# EAGLE design foxBMS_BMS-Interface_V1.00 (EAGLE 6.5.0)
AUTHOR: Fraunhofer IISB foxBMS Team; REL-DATE: 2016-05-20; TITLE: foxBMS BMS-Interface; VERSION: 1.00

## Sheet 1 of 5: Realisierung Jumper
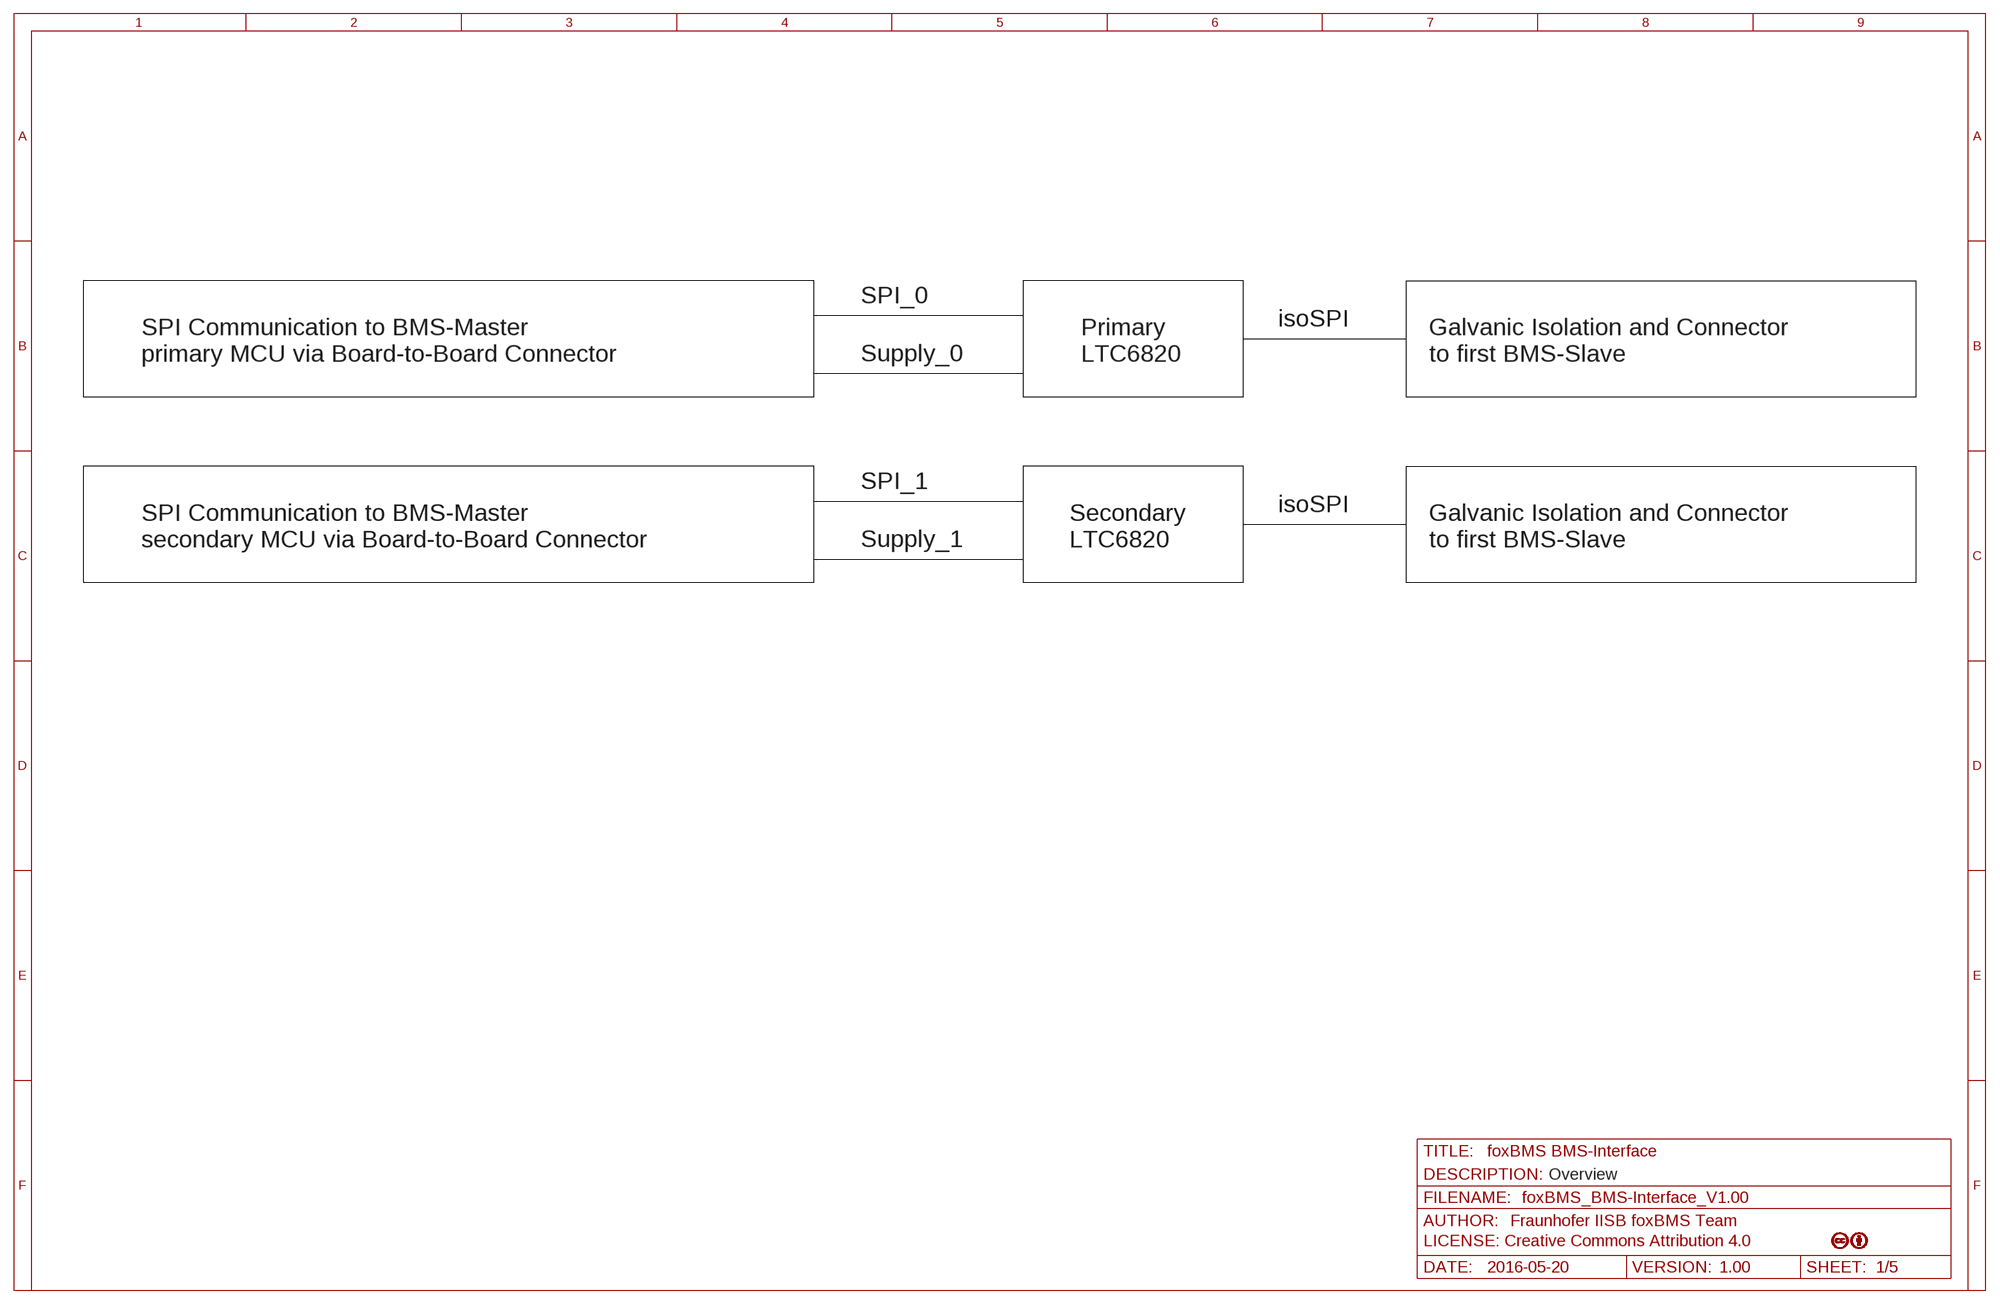
[diagram p0: schematic, sheet 1]

### Notes on the sheet
- SPI_0
- isoSPI
- SPI Communication to BMS-Master
  primary MCU via Board-to-Board Connector
- Supply_0
- Primary
  LTC6820
- Galvanic Isolation and Connector
  to first BMS-Slave
- SPI_1
- isoSPI
- SPI Communication to BMS-Master
  secondary MCU via Board-to-Board Connector
- Supply_1
- Secondary
  LTC6820
- Galvanic Isolation and Connector
  to first BMS-Slave
- Overview

## Sheet 2 of 5
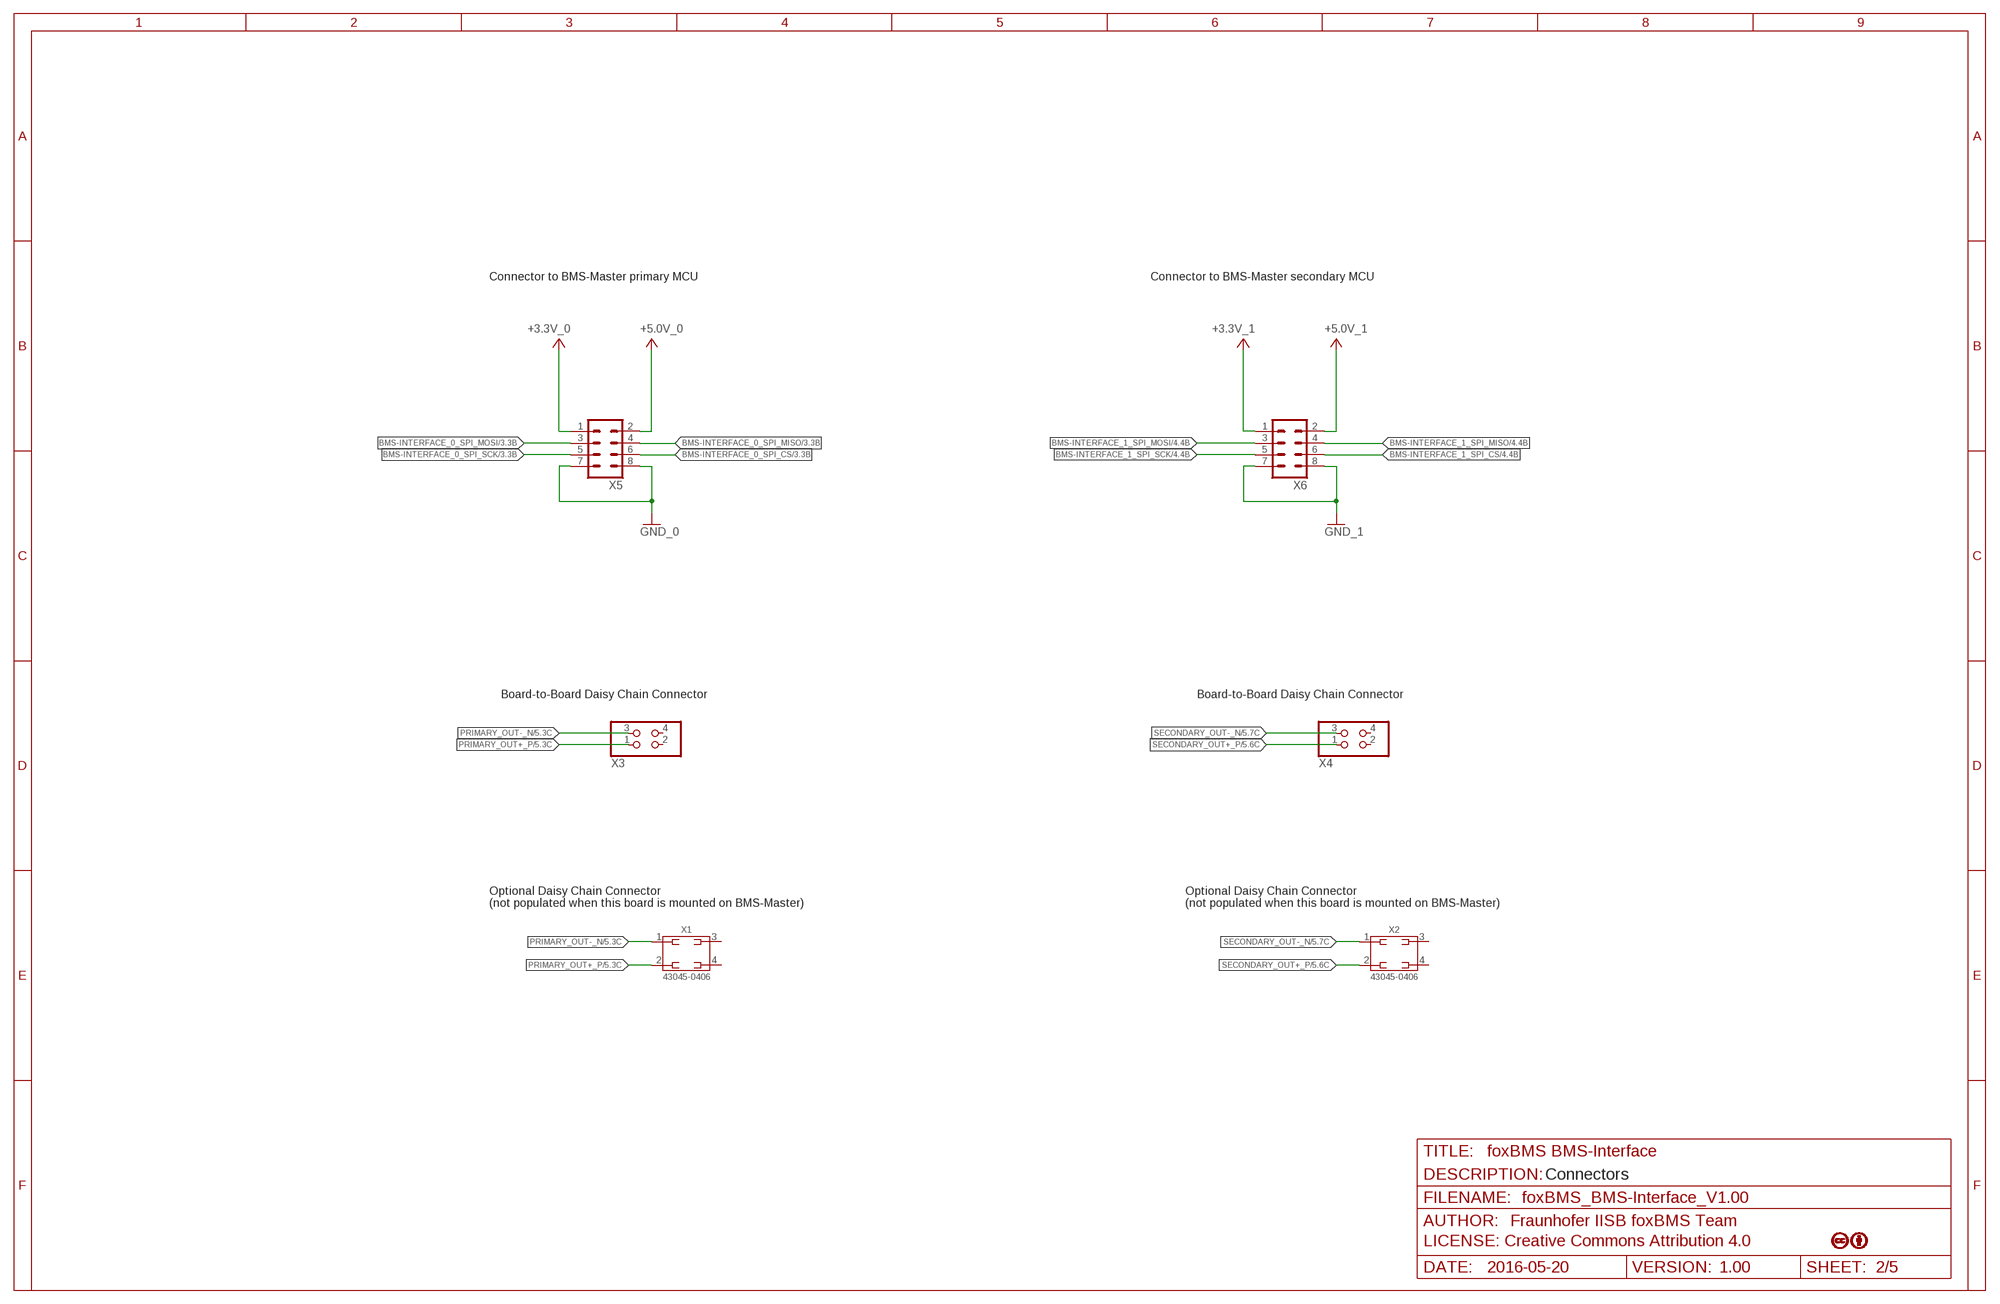
[diagram p1: schematic, sheet 2]

### Parts
X1  43045-0406_MOLEX_4PIN  [X_SMD_MOLEX_43045-0408_R_REV01]
X2  43045-0406_MOLEX_4PIN  [X_SMD_MOLEX_43045-0408_R_REV01]
X3  PINHD-2X2  [2X02]
X4  PINHD-2X2  [2X02]
X5  MA04-2  [MA04-2]
X6  MA04-2  [MA04-2]

### Nets
+3.3V_0: X5.1 ; also sheet 3
+3.3V_1: X6.1 ; also sheet 4
+5.0V_0: X5.2
+5.0V_1: X6.2
BMS-INTERFACE_0_SPI_CS: X5.6 ; also sheet 3
BMS-INTERFACE_0_SPI_MISO: X5.4 ; also sheet 3
BMS-INTERFACE_0_SPI_MOSI: X5.3 ; also sheet 3
BMS-INTERFACE_0_SPI_SCK: X5.5 ; also sheet 3
BMS-INTERFACE_1_SPI_CS: X6.6 ; also sheet 4
BMS-INTERFACE_1_SPI_MISO: X6.4 ; also sheet 4
BMS-INTERFACE_1_SPI_MOSI: X6.3 ; also sheet 4
BMS-INTERFACE_1_SPI_SCK: X6.5 ; also sheet 4
GND_0: X5.7 X5.8 ; also sheet 3,5
GND_1: X6.7 X6.8 ; also sheet 4,5
PRIMARY_OUT+_P [DiffPair]: X1.2 X3.1 ; also sheet 5
PRIMARY_OUT-_N [DiffPair]: X1.1 X3.3 ; also sheet 5
SECONDARY_OUT+_P: X2.2 X4.1 ; also sheet 5
SECONDARY_OUT-_N: X2.1 X4.3 ; also sheet 5
Unconnected: X1.3 X1.4 X2.3 X2.4 X3.2 X3.4 X4.2 X4.4

### Notes on the sheet
- Connector to BMS-Master primary MCU | Connector to BMS-Master secondary MCU
- Board-to-Board Daisy Chain Connector | Board-to-Board Daisy Chain Connector
- Optional Daisy Chain Connector
  (not populated when this board is mounted on BMS-Master)
- Optional Daisy Chain Connector
  (not populated when this board is mounted on BMS-Master)
- Connectors

## Sheet 3 of 5: IC 1
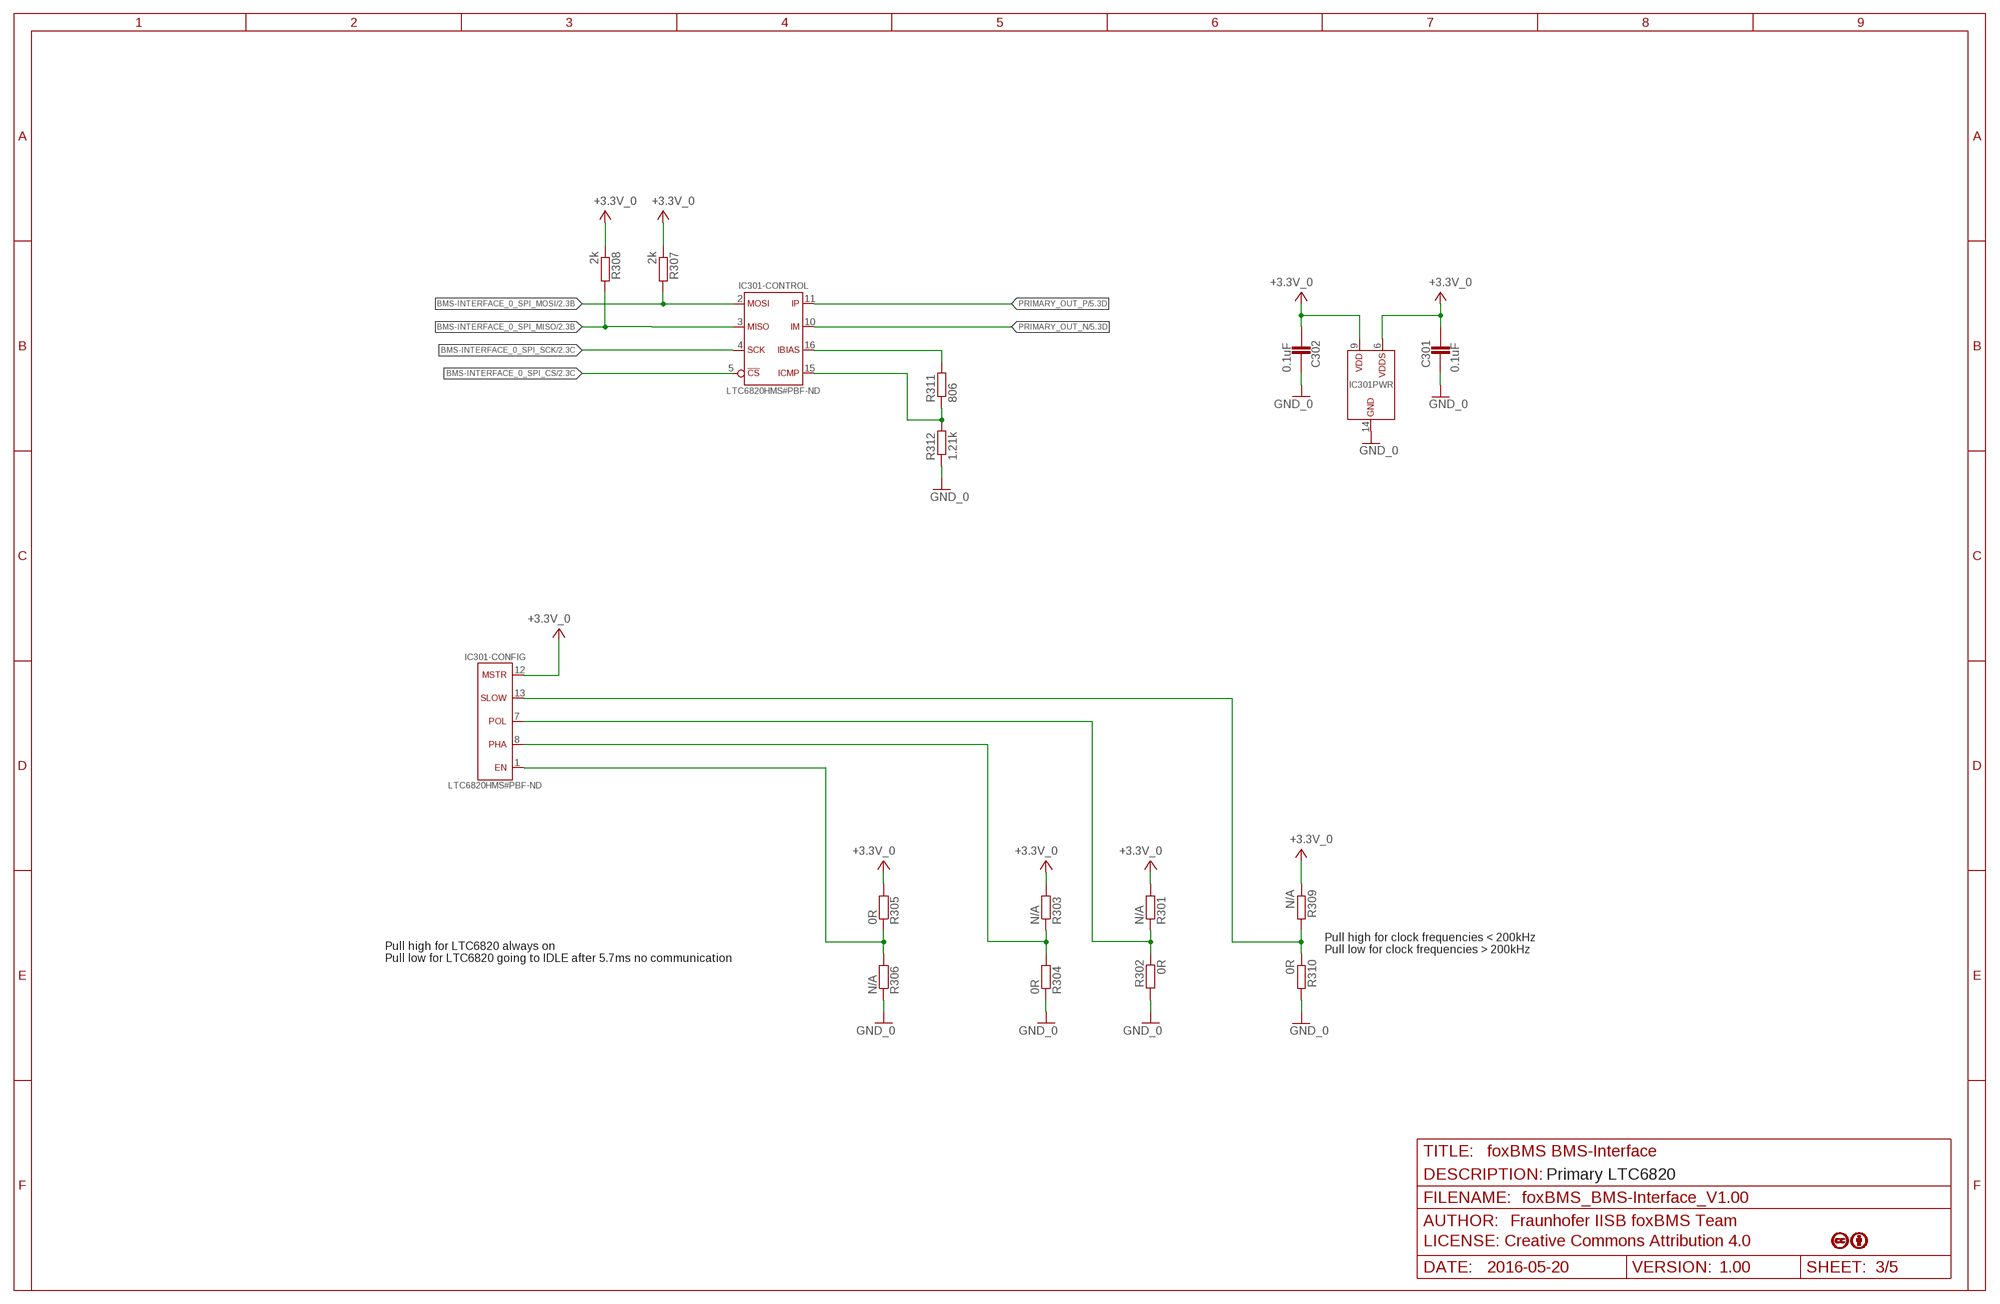
[diagram p2: schematic, sheet 3]

### Parts
C301  0.1uF  C_NP0_0603  [0603]
C302  0.1uF  C_NP0_0603  [0603]
IC301  LTC6820HMS#PBF  [IC_SMD_MSOP-16_(MS16)_R_LINEAR_REV01]
R301  N/A  R_MET_0603  [0603]
R302  0R  R_MET_0603  [0603]
R303  N/A  R_MET_0603  [0603]
R304  0R  R_MET_0603  [0603]
R305  0R  R_MET_0603  [0603]
R306  N/A  R_MET_0603  [0603]
R307  2k  R_MET_0603  [0603]
R308  2k  R_MET_0603  [0603]
R309  N/A  R_MET_0603  [0603]
R310  0R  R_MET_0603  [0603]
R311  806  R_MET_0603  [0603]
R312  1.21k  R_MET_0603  [0603]

### Nets
+3.3V_0: C301.2 C302.2 IC301.6(PWR:VDDS) IC301.9(PWR:VDD) IC301.12(-CONFIG:MSTR) R301.2 R303.2 R305.2 R307.1 R308.1 R309.1 ; also sheet 2
BMS-INTERFACE_0_SPI_CS: IC301.5(-CONTROL:!CS) ; also sheet 2
BMS-INTERFACE_0_SPI_MISO: IC301.3(-CONTROL:MISO) R308.2 ; also sheet 2
BMS-INTERFACE_0_SPI_MOSI: IC301.2(-CONTROL:MOSI) R307.2 ; also sheet 2
BMS-INTERFACE_0_SPI_SCK: IC301.4(-CONTROL:SCK) ; also sheet 2
EN-BACKUP: IC301.1(-CONFIG:EN) R305.1 R306.2
GND_0: C301.1 C302.1 IC301.14(PWR:GND) R302.2 R304.1 R306.1 R310.2 R312.1 ; also sheet 2,5
N$13: IC301.16(-CONTROL:IBIAS) R311.2
N$15: IC301.15(-CONTROL:ICMP) R311.1 R312.2
PHA-PRIMARY: IC301.8(-CONFIG:PHA) R303.1 R304.2
POL-PRIMARY: IC301.7(-CONFIG:POL) R301.1 R302.1
PRIMARY_OUT_N [DiffPair]: IC301.10(-CONTROL:IM) ; also sheet 5
PRIMARY_OUT_P [DiffPair]: IC301.11(-CONTROL:IP) ; also sheet 5
SLOW-PRIMARY: IC301.13(-CONFIG:SLOW) R309.2 R310.1

### Notes on the sheet
- Pull high for LTC6820 always on
  Pull low for LTC6820 going to IDLE after 5.7ms no communication
- Pull high for clock frequencies < 200kHz
  Pull low for clock frequencies > 200kHz
- Primary LTC6820

## Sheet 4 of 5: IC2
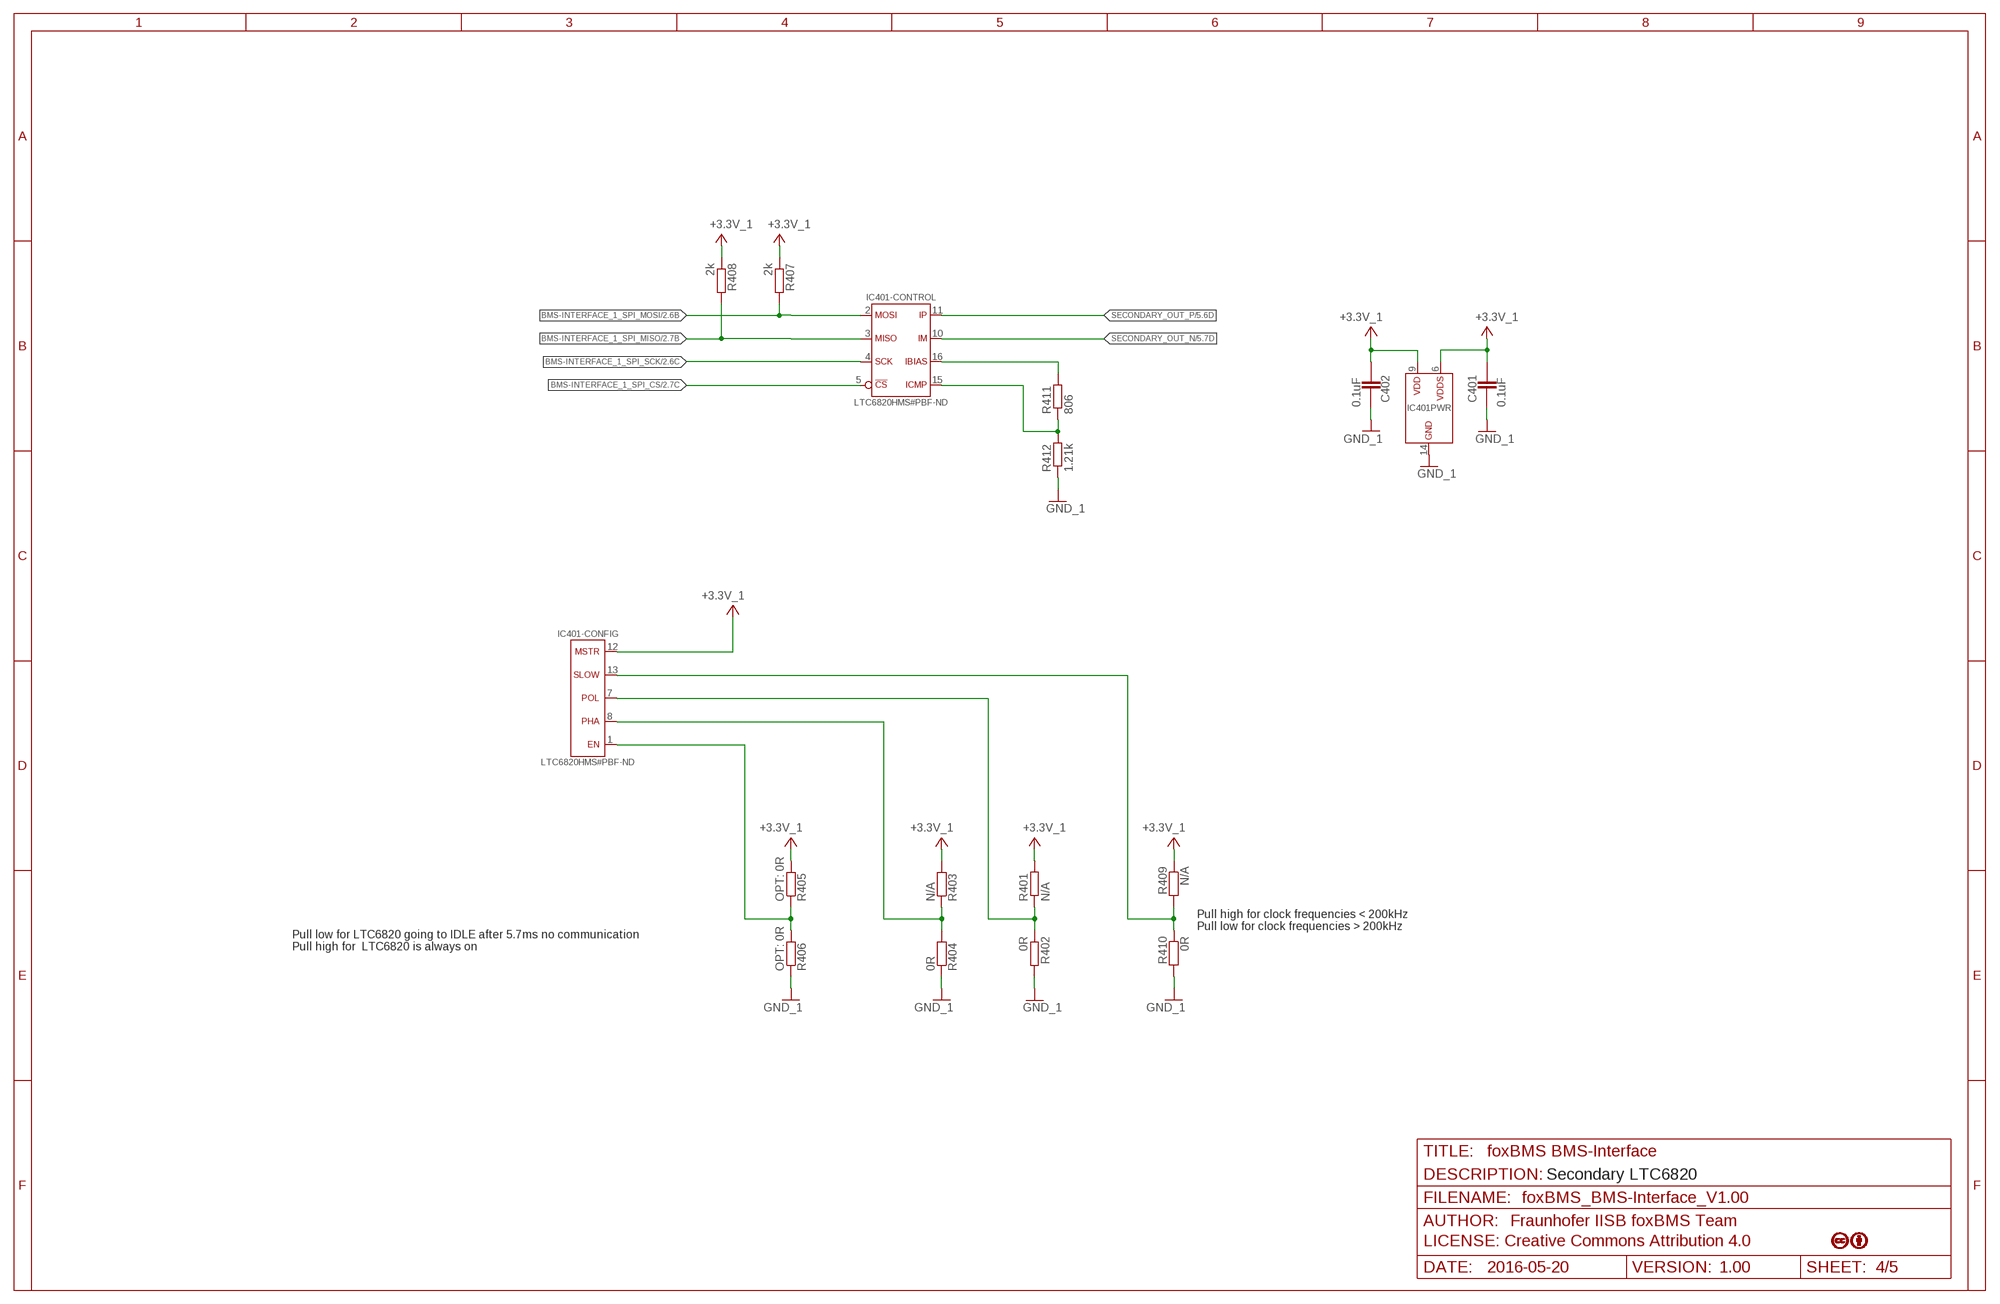
[diagram p3: schematic, sheet 4]

### Parts
C401  0.1uF  C_NP0_0603  [0603]
C402  0.1uF  C_NP0_0603  [0603]
IC401  LTC6820HMS#PBF  [IC_SMD_MSOP-16_(MS16)_R_LINEAR_REV01]
R401  N/A  R_MET_0603  [0603]
R402  0R  R_MET_0603  [0603]
R403  N/A  R_MET_0603  [0603]
R404  0R  R_MET_0603  [0603]
R405  OPT: 0R  R_MET_0603  [0603]
R406  OPT: 0R  R_MET_0603  [0603]
R407  2k  R_MET_0603  [0603]
R408  2k  R_MET_0603  [0603]
R409  N/A  R_MET_0603  [0603]
R410  0R  R_MET_0603  [0603]
R411  806  R_MET_0603  [0603]
R412  1.21k  R_MET_0603  [0603]

### Nets
+3.3V_1: C401.2 C402.2 IC401.6(PWR:VDDS) IC401.9(PWR:VDD) IC401.12(-CONFIG:MSTR) R401.2 R403.2 R405.2 R407.1 R408.1 R409.1 ; also sheet 2
BMS-INTERFACE_1_SPI_CS: IC401.5(-CONTROL:!CS) ; also sheet 2
BMS-INTERFACE_1_SPI_MISO: IC401.3(-CONTROL:MISO) R408.2 ; also sheet 2
BMS-INTERFACE_1_SPI_MOSI: IC401.2(-CONTROL:MOSI) R407.2 ; also sheet 2
BMS-INTERFACE_1_SPI_SCK: IC401.4(-CONTROL:SCK) ; also sheet 2
EN-BACKUP1: IC401.1(-CONFIG:EN) R405.1 R406.2
GND_1: C401.1 C402.1 IC401.14(PWR:GND) R402.2 R404.1 R406.1 R410.2 R412.1 ; also sheet 2,5
N$1: IC401.15(-CONTROL:ICMP) R411.1 R412.2
N$4: IC401.16(-CONTROL:IBIAS) R411.2
PHA-SECONDARY: IC401.8(-CONFIG:PHA) R403.1 R404.2
POL-SECONDARY: IC401.7(-CONFIG:POL) R401.1 R402.1
SECONDARY_OUT_N: IC401.10(-CONTROL:IM) ; also sheet 5
SECONDARY_OUT_P: IC401.11(-CONTROL:IP) ; also sheet 5
SLOW-SECONDARY: IC401.13(-CONFIG:SLOW) R409.2 R410.1

### Notes on the sheet
- Pull low for LTC6820 going to IDLE after 5.7ms no communication
  Pull high for  LTC6820 is always on
- Pull high for clock frequencies < 200kHz
  Pull low for clock frequencies > 200kHz
- Secondary LTC6820

## Sheet 5 of 5: Stecker
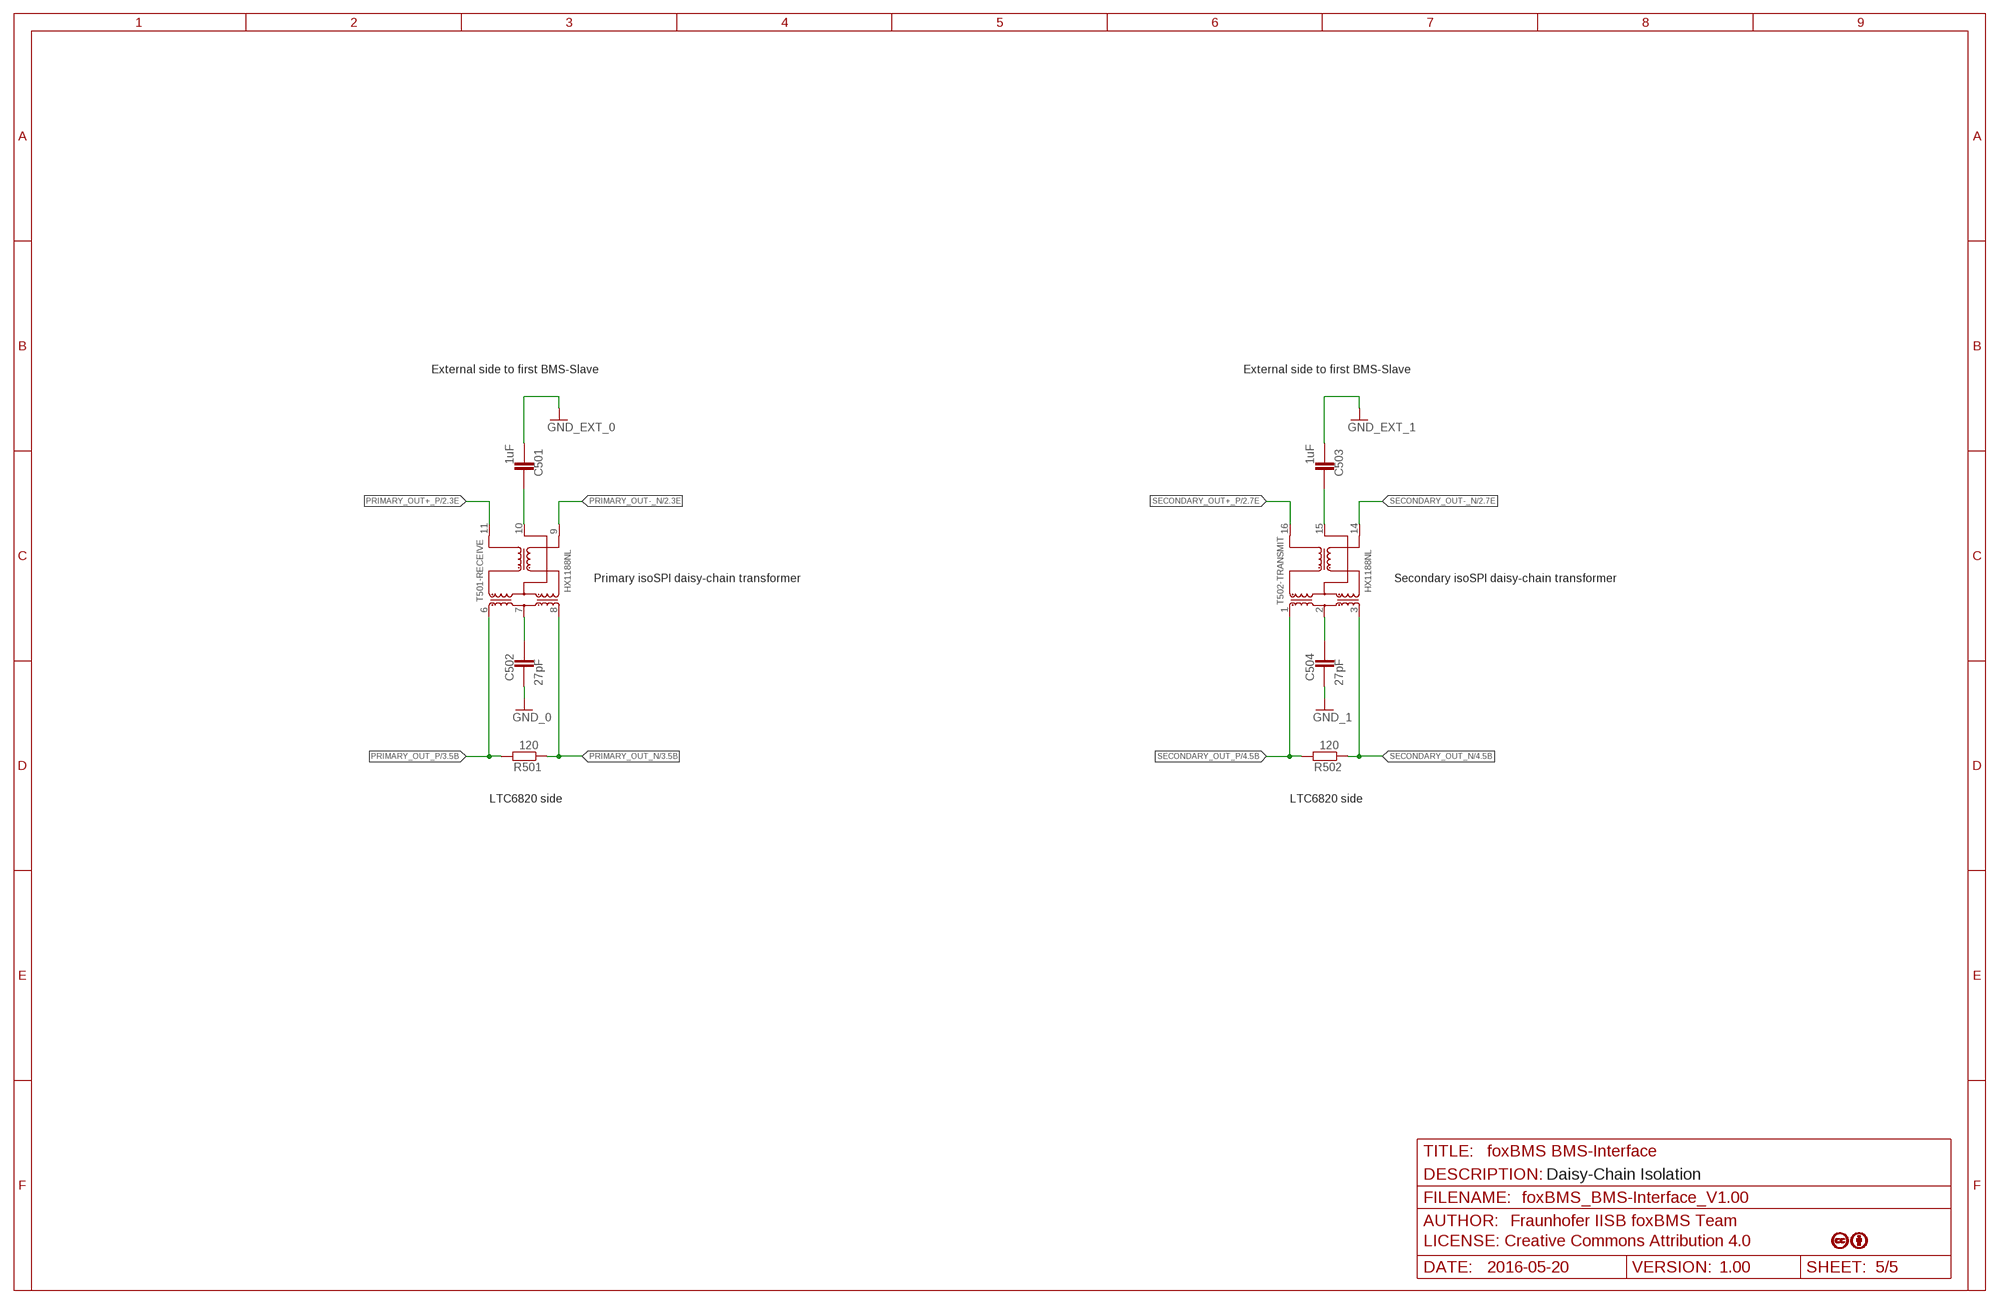
[diagram p4: schematic, sheet 5]

### Parts
C501  1uF  C_NP0_0603  [0603]
C502  27pF  C_NP0_0603  [0603]
C503  1uF  C_NP0_0603  [0603]
C504  27pF  C_NP0_0603  [0603]
R501  120  R_MET_0603  [0603]
R502  120  R_MET_0603  [0603]
T501  HX1188NL  [TR_SMD_SOIC-16_(12,70MMX9,53MMX5,97MM)_R_PULSE_REV01]
T502  HX1188NL  [TR_SMD_SOIC-16_(12,70MMX9,53MMX5,97MM)_R_PULSE_REV01]

### Nets
GND_0: C502.1 ; also sheet 2,3
GND_1: C504.1 ; also sheet 2,4
GND_EXT_0: C501.1
GND_EXT_1: C503.1
N$21: C504.2 T502.2(-TRANSMIT:CT)
N$22: C503.2 T502.15(-TRANSMIT:CMT)
N$23: C502.2 T501.7(-RECEIVE:CT)
N$24: C501.2 T501.10(-RECEIVE:CMT)
PRIMARY_OUT+_P [DiffPair]: T501.11(-RECEIVE:X+) ; also sheet 2
PRIMARY_OUT-_N [DiffPair]: T501.9(-RECEIVE:X-) ; also sheet 2
PRIMARY_OUT_N [DiffPair]: R501.1 T501.8(-RECEIVE:D-) ; also sheet 3
PRIMARY_OUT_P [DiffPair]: R501.2 T501.6(-RECEIVE:D+) ; also sheet 3
SECONDARY_OUT+_P: T502.16(-TRANSMIT:X+) ; also sheet 2
SECONDARY_OUT-_N: T502.14(-TRANSMIT:X-) ; also sheet 2
SECONDARY_OUT_N: R502.1 T502.3(-TRANSMIT:D-) ; also sheet 4
SECONDARY_OUT_P: R502.2 T502.1(-TRANSMIT:D+) ; also sheet 4
Unconnected: T501.1(-TRANSMIT:D+) T501.2(-TRANSMIT:CT) T501.3(-TRANSMIT:D-) T501.4(NC1:NC) T501.5(NC2:NC) T501.12(NC3:NC) T501.13(NC4:NC) T501.14(-TRANSMIT:X-) T501.15(-TRANSMIT:CMT) T501.16(-TRANSMIT:X+) T502.4(NC1:NC) T502.5(NC2:NC) T502.6(-RECEIVE:D+) T502.7(-RECEIVE:CT) T502.8(-RECEIVE:D-) T502.9(-RECEIVE:X-) T502.10(-RECEIVE:CMT) T502.11(-RECEIVE:X+) T502.12(NC3:NC) T502.13(NC4:NC)

### Notes on the sheet
- External side to first BMS-Slave | External side to first BMS-Slave
- Primary isoSPI daisy-chain transformer | Secondary isoSPI daisy-chain transformer
- LTC6820 side | LTC6820 side
- Daisy-Chain Isolation

## Library data of the parts
C301 C302 C401 C402 C501-C504 = custom_passiv:C*: Kondensator Bitte gleich beim Einfügen vorgesehenen Werkstoff auswählen. 0402 NP0: #2759 0402 X7R: #1977 0402 Y5V: #2761 0603 X7R: #191 0603 Y5V: #497 0805 NP0: #74 0805 X7R: #104 1206 NP0: #102 1206 X7R: #98 1210 X7R: #114 1812 X7R: #335
IC301 IC401 = 0_LES_SCHNITTSTELLEN-IC.SMD.ISO-TRANSCEIVER:LTC6820*?: LTC6820 - Linear Technology Datasheet www <http://cds.linear.com/docs/en/datasheet/6820fa.pdf> Datasheet local <file:///C:\Eagle-Datasheet\Schnittstellen-IC\LTC6820_Linear.pdf> isoSPI Isolated Communications Interface - 1Mbps Isolated SPI Data Communications - Simple Galvanic Isolation Using Standard Transformers - Bidirectional Interface Over a Single Twisted Pair - Supports Cable Lengths Up to 100 Meters - Very Low EMI Susceptibility and Emissions - Configurable for High Noise Immunity or Low Power - Engineered for ISO26262 Compliant Systems - Requires No Software Changes in Most SPI Systems - Ultralow, 2μA Idle Current - Automatic Wake-Up Detection - Operating Temperature Range: –40°C to 125°C - 2.7V to 5.5V Power Supply - Interfaces to All Logic from 1.7V to 5.5V - Available in 16-Lead QFN and MSOP Packages Revision Date changed by Changes ------------------------------------------------------------------------------------------ V1.0 21.04.2016 SC Ersterstellung; DISTRI_1: Digi-Key; DISTRI_1-NR: LTC6820HMS#PBF-ND; DISTRI_1-PREIS: 4,82€; HERSTELLER: Linear Technology; HERSTELLER-NR: LTC6820HMS#PBF-ND; MARKING: 6820; PDF-LOCAL: file:///C:\Eagle-Datasheet\Schnittstellen-IC\LTC6820_Linear.pdf; SIZE: MSOP-16; UIDD_TYP: 6,00µA; UKAT: I; UTERM: Sn; UTMAX: 125°C; UTMIN: -40°C; UTYP: ISO-Transceiver; UVAL: LTC6820HMS#PBF-ND; UVDDS_MAX: 5,50V; UVDDS_MIN: 1,70V; UVDD_MAX: 5,50V; UVDD_MIN: 2,70V
R301-R312 R401-R412 R501 R502 = custom_passiv:R*: Widerstand: Bitte gleich beim Einfügen vorgesehenen Werkstoff wählen. 0R_0402: #2765 0R_0603: #2227 0R_0805: #2229 Met_0402: #2767 Met_0603: #801 Met_0805: #1095 Met_1206: #1389 Met_MINIMELF: #1683 MET_E96_0402: #2769 MET_E96_0603: #5 MET_E96_0805: #1230 MET_E96_1206: #286 MET_E96_MICROMELF: #1979 MET_E96_MINIMELF: #536
T501 T502 = 0_LES_TRANSFORMER.SMD:HX1188NL: HX1188NL - Pulse Electronic Datasheet www <http://productfinder.pulseeng.com/products/datasheets/HX1188NL.pdf> Datasheet local <file:///C:/Eagle-Datasheet/Transformer/HX1188NL_Pulse.pdf> Ethernet Transformator HX1188NL - Pulse Electronic - Isolierspannung: 1,50kV - Frequenz: 100kHz - 100MHz - Nicht kurzschlussfest - unshielded Revision Date changed by Changes ------------------------------------------------------------------------------------------ V1.0 21.04.2016 SC Ersterstellung; DISTRI_1: Digi-Key; DISTRI_1-NR: 553-1340-ND; DISTRI_1-PREIS: 4,80€; HERSTELLER: Pulse Electronic; HERSTELLER-NR: HX1188NL; MARKING: HX1188NL; PDF-LOCAL: file:///C:/Eagle-Datasheet/Transformer/HX1188NL_Pulse.pdf; SIZE: SOIC-16; UKAT: I; UTERM: Sn; UTMAX: 85°C; UTMIN: -40°C; UTYP: Transformer; UVAL: HX1188NL; UVISO: 1,65kV
X1 X2 = 0_LES_STECKVERBINDUNG.SMD.RASTER_3,00MM.BUCHSE:43045-040?*_MOLEX_4PIN: 43045-Serie - MOLEX 43045-0406 Datasheet www <http://www.molex.com/webdocs/datasheets/pdf/en-us/0430450406_PCB_HEADERS.pdf> Datasheet local <file:///C:\Eagle-Datasheet\Steckverbindung\430450406_Molex.pdf> 43045-0407 Datasheet www <http://www.molex.com/webdocs/datasheets/pdf/en-us/0430450407_PCB_HEADERS.pdf> Datasheet local <file:///C:\Eagle-Datasheet\Steckverbindung\430450407_Molex.pdf> 43045-0408 Datasheet www <http://www.molex.com/webdocs/datasheets/pdf/en-us/0430450408_PCB_HEADERS.pdf> Datasheet local <file:///C:\Eagle-Datasheet\Steckverbindung\430450408_Molex.pdf> - 4-Pin Buchse - liegend - Package - 2 reihig x 2-Pins - Size: 15,40mm x 9,65mm x 10,29mm - RM: 3,00mm - Farbe: Schwarz - Material: High Temperature Thermoplastic Revision Date changed by Changes ------------------------------------------------------------------------------------------ V1.0 17.12.2015 SC Ersterstellung; DISTRI_1: Mouser; DISTRI_1-NR: 538-43045-0406; DISTRI_1-PREIS: 2,22€; DISTRI_2: Digi-Key; DISTRI_2-NR: WM3249CT-ND; DISTRI_2-PREIS: 2,34€; HERSTELLER: Molex; HERSTELLER-NR: 43045-0406; PDF-LOCAL: file:///C:\Eagle-Datasheet\Steckverbindung\430450406_Molex.pdf; SIZE: 15,40mm x 6,65mm x 10,29mm; UCOLOR: Schwarz; UIN_MAX: 5,00A; UKAT: C; UMAT: High Temperature Thermoplastic; URISO: 1,00GOhm; UTERM: Sn; UTERMPLAT: 254nm; UTMAX: 105°C; UTMIN: -40°C; UTYP: Buchse; UVAL: 43045-0406; UVCC_MAX: 600V
X3 X4 = pinhead:PINHD-2X2: PIN HEADER
X5 X6 = foxBMS_BMS-Interface_V1.1_MW:MA04-2: PIN HEADER; OC_FARNELL: unknown; OC_NEWARK: unknown

## Net classes
0 default: width 0.152 mm, clearance 0.152 mm
1 DiffPair: width 0.254 mm, clearance 0.152 mm

## Board
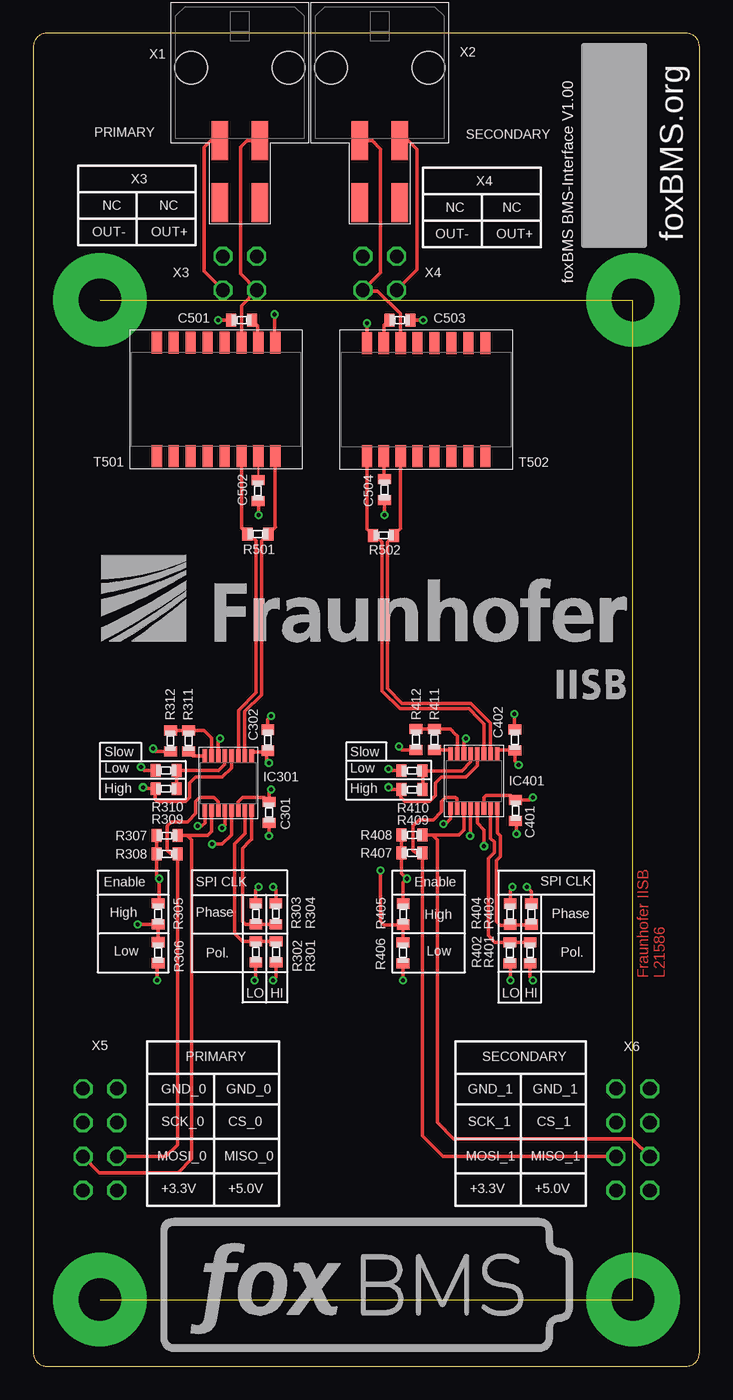
[diagram p5: board, top side]
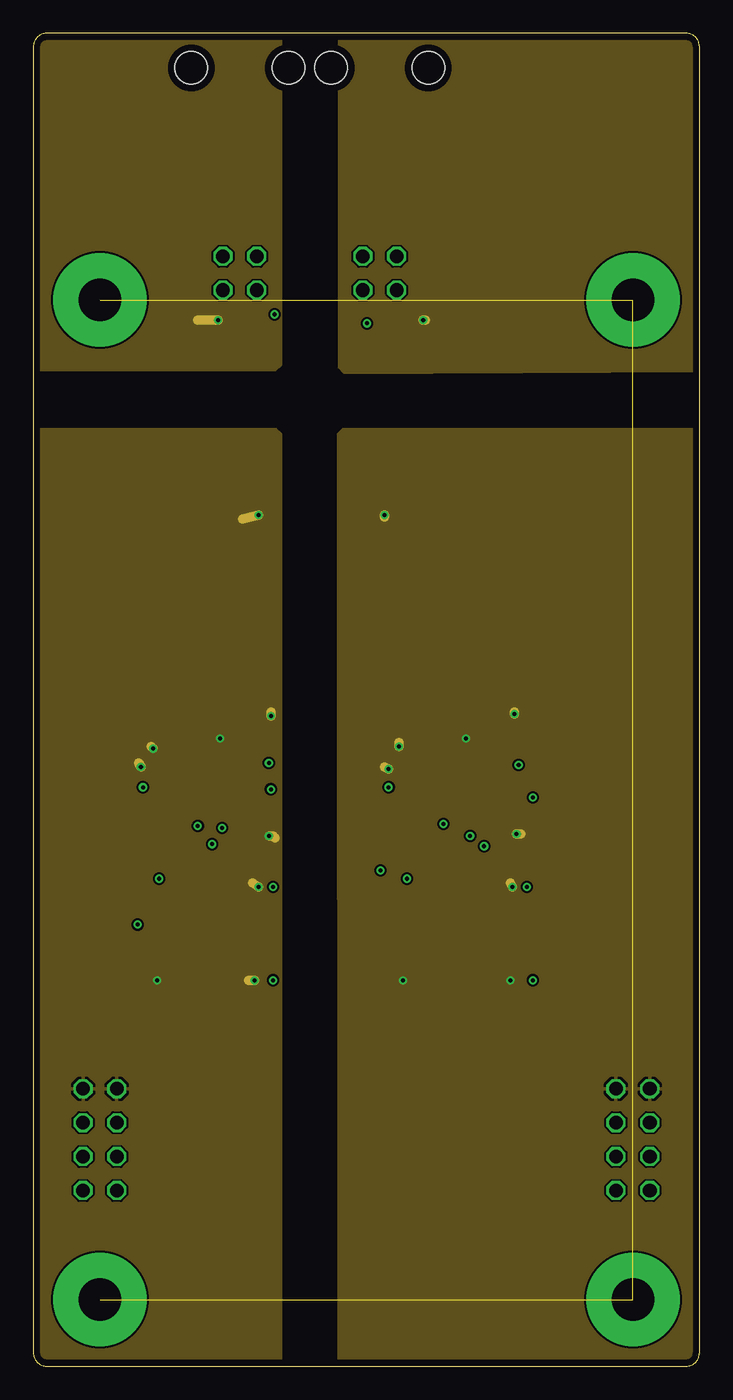
[diagram p6: board, inner layer GND]
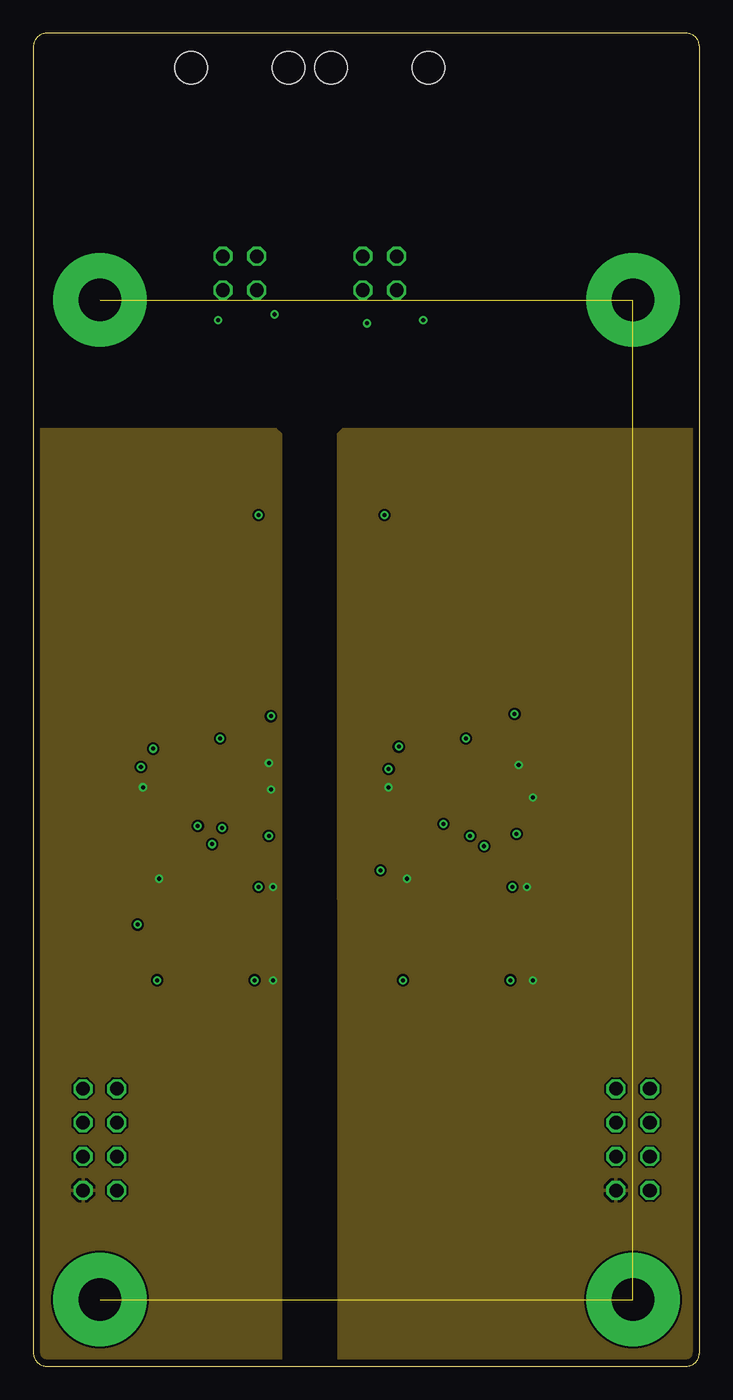
[diagram p7: board, inner layer Route3]
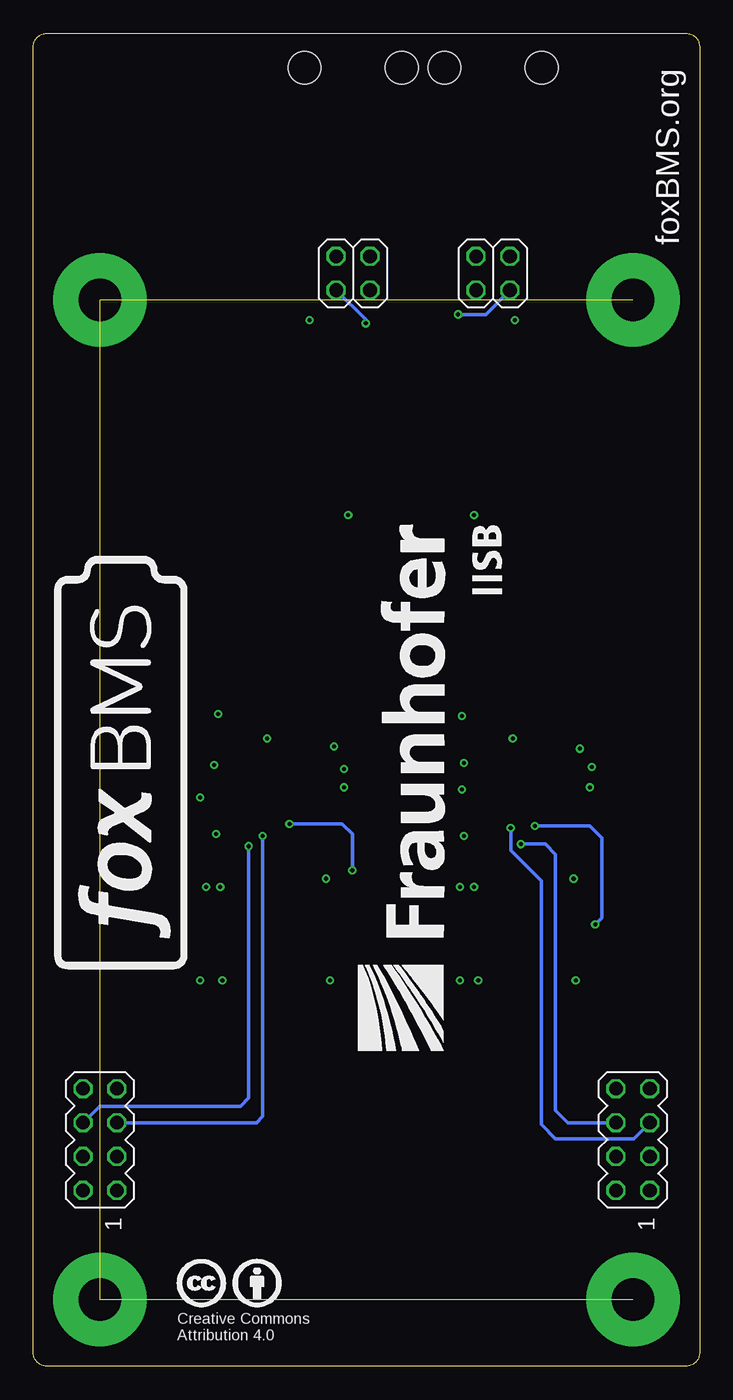
[diagram p8: board, bottom side, seen from below]

Size 50 x 100 mm. Coordinates in mm from the lower left corner, seen from the top.
Outline: 0,99 0,1 arc90 1,0 49,0 arc90 50,1 50,99 arc90 49,100 1,100 arc90 0,99
Copper layers (1+2*3+16): Top 0.018mm / dielectric 0.36mm / GND 0.035mm / dielectric 0.71mm / Route3 0.035mm / dielectric 0.36mm / Bottom 0.018mm
Design rules "Aetzwerk-DRC 4 Lagen 35µm Cu *": minimum track width 6mil, minimum drill 12mil, track to track 6mil, track to pad 6mil, pad to pad 6mil, via to via 6mil, smd to smd 6mil, copper to edge 20mil, drill to drill 8mil, minimum pad ring 8mil, minimum via ring 6mil, stop-mask expansion 3mil, vias tented up to drill 0.31mm, thermal gap 8mil

### Footprints (pad centres in the part's own frame; a part is rotated, then mirrored left to right if it is on the bottom)
0603 = smd 0.762 x 0.965: 1 -0.787,0; 2 0.787,0
IC_SMD_MSOP-16_(MS16)_R_LINEAR_REV01 = smd 0.343 x 1.016: 1 -1.75,-2.042; 2 -1.25,-2.042; 3 -0.75,-2.042; 4 -0.25,-2.042; 5 0.25,-2.042; 6 0.75,-2.042; 7 1.25,-2.042; 8 1.75,-2.042; 9 1.75,2.042; 10 1.25,2.042; 11 0.75,2.042; 12 0.25,2.042; 13 -0.25,2.042; 14 -0.75,2.042; 15 -1.25,2.042; 16 -1.75,2.042
TR_SMD_SOIC-16_(12,70MMX9,53MMX5,97MM)_R_PULSE_REV01 = smd 0.76 x 1.65: 1 -4.445,-4.255; 2 -3.175,-4.255; 3 -1.905,-4.255; 4 -0.635,-4.255; 5 0.635,-4.255; 6 1.905,-4.255; 7 3.175,-4.255; 8 4.445,-4.255; 9 4.445,4.255; 10 3.175,4.255; 11 1.905,4.255; 12 0.635,4.255; 13 -0.635,4.255; 14 -1.905,4.255; 15 -3.175,4.255; 16 -4.445,4.255
X_SMD_MOLEX_43045-0408_R_REV01 = smd 1.27 x 2.92: 1 1.5,5.47; 2 -1.5,5.47; 3 1.5,10.1; 4 -1.5,10.1 | hole 2.46: -3.65,0; 3.65,0
2X02 = drill 1.016 octagon: 1 -1.27,-1.27; 2 -1.27,1.27; 3 1.27,-1.27; 4 1.27,1.27
MA04-2 = drill 1.016 octagon: 1 -3.81,-1.27; 2 -3.81,1.27; 3 -1.27,-1.27; 4 -1.27,1.27; 5 1.27,-1.27; 6 1.27,1.27; 7 3.81,-1.27; 8 3.81,1.27

### Placement (x,y rotation side)
C301  17.7,41.54 90 top
C302  17.6,46.97 270 top
C401  36.2,41.68 90 top
C402  36.14,46.99 270 top
C501  15.64,78.49 0 top
C502  16.86,65.69 90 top
C503  27.51,78.49 180 top
C504  26.37,65.76 90 top
IC301  14.63,43.74 0 top
IC401  33.07,43.89 0 top
R301  18.23,31.07 270 top
R302  16.7,31.07 270 top
R303  18.2,33.94 90 top
R304  16.7,33.93 270 top
R305  9.37,33.92 90 top
R306  9.37,31.02 90 top
R307  10.03,39.81 0 top
R308  10.03,38.43 0 top
R309  9.97,43.33 0 top
R310  9.96,44.7 180 top
R311  11.67,46.91 270 top
R312  10.29,46.91 90 top
R401  37.29,31.01 270 top
R402  35.76,31.01 270 top
R403  37.39,33.91 90 top
R404  35.79,33.91 270 top
R405  27.76,33.91 90 top
R406  27.74,31.01 90 top
R407  28.42,38.51 0 top
R408  28.42,39.85 0 top
R409  28.42,43.26 0 top
R410  28.42,44.68 180 top
R411  30.1,47.02 270 top
R412  28.73,47.02 90 top
R501  16.86,62.44 180 top
R502  26.29,62.33 180 top
T501  13.72,72.54 0 top
T502  29.48,72.52 0 top
X1  15.5,97.41 180 top
X2  26,97.41 180 top
X3  15.5,82 0 bottom
X4  26,82 0 bottom
X5  5,17 90 bottom
X6  45,17 90 bottom

### Tracks (layer width: path | path; a pad name or v marks a point on that pad's centre or on a via)
+3.3V_0  (via drill 0.3)
  Top 0.152: C302.2
  Top 0.254: 17.5,46.08 C302.2 | 17.5,46.08 17.5,45.44 v17.68,45.26 | R303.2 18.2,35.75 v17.98,35.97 | R301.2 18.23,29.2 v17.98,28.96 | v17.83,43.28 17.7,43.15 C301.2 17.36,42.67 15.7,42.67 15.37,42.35 IC301.6 | R305.2 9.45,34.79 v9.45,36.58 9.24,36.78 R308.1 R307.1 | v8.23,43.43 8.23,43.33 R309.1 9.14,43.29 9.14,42.52 9.3,42.37 11.43,42.37 11.73,42.67 11.73,43.74 12.19,44.2 14.17,44.2 14.87,44.9 IC301.12 | 17.5,46.08 16.38,46.08 IC301.9
  pour Route3: 0,0 0,70.35 18.2,70.35 18.59,69.95 18.59,0
+3.3V_1  (via drill 0.3)
  Top 0.254: v36.42,45.11 36.14,45.39 C402.2 36.11,46.24 34.82,46.24 IC401.9 | v37.49,42.67 37.29,42.47 C401.2 35.84,42.82 33.98,42.82 33.82,42.66 IC401.6 | R403.2 37.39,35.61 v37.03,35.97 | R401.2 37.29,29.21 v37.49,28.96 | R405.2 27.76,36.3 v28.04,36.58 27.64,36.98 R407.1 R408.1 | v26.67,43.43 26.85,43.26 R409.1 27.58,43.36 27.58,42.67 27.89,42.37 29.72,42.37 30.18,42.82 30.18,43.74 30.63,44.2 32.46,44.2 33.32,45.06 IC401.12
  pour Route3: 22.9,0 22.86,69.95 23.26,70.35 50,70.35 50,0
BMS-INTERFACE_0_SPI_CS  (via drill 0.3)
  Top 0.254: v13.41,39.17 14.17,39.17 14.87,39.87 IC301.5
  Bottom 0.254: v13.41,39.17 11.58,39.17 10.82,38.41 10.82,19.2 9.89,18.27 X5.6
BMS-INTERFACE_0_SPI_MISO
  Top 0.203: IC301.3 13.87,41.7 13.87,41.76
  Top 0.254: 13.87,41.49 13.87,41.76 13.87,42.37 13.56,42.67 12.5,42.67 12.19,42.37 12.19,41.45 11.58,40.84 10.36,40.84 10.06,40.54 10.06,38.71 10.34,38.43 R308.2 10.82,16.61 9.94,15.73 X5.4
BMS-INTERFACE_0_SPI_MOSI
  Top 0.254: R307.2 11.55,39.81 | 11.55,39.81 11.89,39.47 11.89,15.54 10.85,14.51 4.95,14.51 X5.3 | 11.55,39.81 13.08,39.81 13.38,40.11 IC301.2
BMS-INTERFACE_0_SPI_SCK  (via drill 0.3)
  Top 0.254: 14.37,40.59 v14.17,40.39 14.38,40.59 IC301.4
  Bottom 0.254: v14.17,40.39 14.17,38.71 11.89,36.42 11.89,18.14 10.8,17.05 4.95,17.05 X5.5
BMS-INTERFACE_1_SPI_CS  (via drill 0.3)
  Top 0.254: v33.83,39.01 33.83,40.23 33.32,40.75 IC401.5
  Bottom 0.254: v33.83,39.01 33.83,20.12 34.44,19.51 45.03,19.51 X6.6
BMS-INTERFACE_1_SPI_MISO
  Top 0.254: 29.95,39.85 30.33,39.47 30.33,18.29 31.55,17.07 44.93,17.07 X6.4 | 29.95,39.85 R408.2 | 29.95,39.85 31.93,39.85 32.32,40.25 IC401.3
BMS-INTERFACE_1_SPI_MOSI
  Top 0.254: X6.3 30.75,15.73 29.21,17.27 R407.2 28.7,38.51 28.5,38.71 28.5,40.54 28.96,41 30.02,41 30.63,41.6 30.63,42.37 30.94,42.67 31.7,42.67 31.79,42.59 31.79,41.88 IC401.2
BMS-INTERFACE_1_SPI_SCK  (via drill 0.3)
  Top 0.254: IC401.4 32.82,39.81 v32.78,39.78
  Bottom 0.254: v32.78,39.78 32.78,18.75 33.26,18.27 X6.5
EN-BACKUP  (via drill 0.3)
  Top 0.254: R306.2 R305.1 v7.83,33.13 | v12.34,40.54 12.65,40.54 12.88,40.77 IC301.1
  Bottom 0.254: v12.34,40.54 8.23,40.54 7.32,39.62 7.32,33.65 v7.83,33.13
EN-BACKUP1  (via drill 0.3)
  Top 0.254: R406.2 27.74,33.1 R405.1 26.31,33.12 26.06,33.38 v26.06,37.19 | v30.79,40.69 30.94,40.69 31.32,41.07 IC401.1
  Bottom 0.254: v30.79,40.69 26.82,40.69 26.06,39.93 v26.06,37.19
GND_0  (via drill 0.3)
  Top 0.254: C301.1 17.7,39.91 v17.68,39.78 | R304.1 16.7,35.73 v16.92,35.97 | R302.2 16.7,29.19 v16.61,28.96 | C302.1 17.6,48.53 v17.83,48.77 | R312.1 9.2,46.12 v8.99,46.33 | R310.2 8.33,44.7 v8.08,44.96 | C502.1 16.92,64.9 v16.92,63.86 | R306.1 9.3,30.24 v9.3,28.96 | IC301.14 13.88,46.95 v14.02,47.09
  GND 0.711: v17.68,39.78 17.98,39.78 18.14,39.62 | v16.92,35.97 16.46,36.27 | v16.61,28.96 16.15,28.96 | v17.83,48.77 17.83,49.07 | v8.99,46.33 8.84,46.48 | v8.08,44.96 7.92,45.26 | v16.92,63.86 15.7,63.55
  pour GND: 0,0 0,70.35 18.2,70.35 18.59,69.95 18.6,0
GND_1  (via drill 0.3)
  Top 0.254: R406.1 v27.74,28.96 | 35.81,34.72 35.81,35.66 v35.97,35.97 | 35.81,30.18 v35.81,28.96 | 36.27,40.82 v36.27,39.93 | 36.12,47.8 v36.12,48.92 | C504.1 v26.36,63.86 | R412.1 27.69,46.23 v27.43,46.48 | R410.2 26.8,44.68 v26.67,44.81 | IC401.14 32.32,46.95 v32.46,47.09
  Top 0.711: R404.1 35.81,34.72 | R402.2 35.81,30.18 | C401.1 36.27,40.82 | C402.1 36.12,47.8
  GND 0.711: v35.97,35.97 35.81,36.27 | v36.27,39.93 36.58,39.93 | v36.12,48.92 36.12,49.07 | v26.67,44.81 26.36,44.96 | v26.36,63.86 26.36,63.7 | v27.43,46.48 27.43,46.79
  pour GND: 22.9,0 22.86,69.95 23.26,70.35 50,70.35 50,0
GND_EXT_0  (via drill 0.3)
  Top 0.254: C501.1 14.7,78.49 v13.87,78.49
  GND 0.711: v13.87,78.49 12.34,78.49
  pour GND: 18.6,75.11 18.14,74.68 0,74.65 0,100 18.6,100
GND_EXT_1  (via drill 0.3)
  Top 0.254: C503.1 v29.26,78.49
  GND 0.711: v29.26,78.49 29.41,78.49
  pour GND: 22.9,100 22.9,74.94 23.32,74.52 50,74.65 49.99,77.11 50,100
N$1
  Top 0.254: R412.2 R411.1 31.29,47.8 31.7,47.4 31.79,47.31 31.82,47.27 IC401.15
N$4
  Top 0.254: R411.2 30.11,46.24 31.32,46.24 IC401.16
N$13
  Top 0.254: 11.71,46.08 R311.2 12.01,45.78 IC301.16
N$15
  Top 0.254: R312.2 R311.1 12.8,47.7 13.37,47.13 IC301.15
N$21
  Top 0.254: 26.32,66.59 26.32,68.24 T502.2
  Top 0.711: C504.2 26.32,66.59
N$22
  Top 0.254: C503.2 26.32,78.09 26.32,76.8 T502.15
N$23
  Top 0.152: 16.89,66.51 T501.7
  Top 0.254: 16.89,66.51 C502.2
N$24
  Top 0.254: C501.2 16.84,78.07 16.84,76.84 T501.10
N$36  (via drill 3.2 pad 7)  (3 unrouted)
  other vias: 5,5 45,5 5,80 45,80
PHA-PRIMARY
  Top 0.254: R303.1 18.19,33.14 R304.2 15.93,33.14 15.7,33.38 15.7,38.86 16.23,39.4 16.37,39.54 16.38,39.55 IC301.8
PHA-SECONDARY
  Top 0.254: R403.1 R404.2 35.74,33.07 35.05,33.07 34.75,33.38 34.75,37.95 35.05,38.25 35.05,39.78 34.82,40.01 IC401.8
POL-PRIMARY
  Top 0.254: R301.1 R302.1 15.7,31.85 15.09,32.46 15.09,39.17 15.88,39.96 IC301.7
POL-SECONDARY
  Top 0.254: R401.1 R402.1 34.65,31.8 34.14,32.31 34.14,38.1 34.59,38.56 34.59,39.32 34.32,39.59 IC401.7
PRIMARY_OUT+_P
  Top 0.254: 16.74,80.7 X3.1 | X1.2 16.04,91.94 15.54,91.44 15.54,81.95 X3.1 | X3.1 15.62,79.58 T501.11
PRIMARY_OUT-_N  (via drill 0.3)
  Top 0.254: X1.1 13.3,91.94 12.8,91.44 12.8,82.16 X3.3 | v18.12,78.91 18.12,76.84 T501.9
  Bottom 0.254: v18.12,78.91 16.05,78.91 X3.3
PRIMARY_OUT_N
  Top 0.254: T501.8 18.16,62.96 R501.1 17.12,61.91 17.12,50.36 15.87,49.11 IC301.10
PRIMARY_OUT_P
  Top 0.254: T501.6 15.62,62.88 R501.2 16.71,61.94 16.71,50.53 15.39,49.21 15.39,45.79 IC301.11
SECONDARY_OUT+_P  (via drill 0.3)
  Top 0.254: X2.2 28.15,91.94 28.8,91.29 28.8,82.26 X4.1 | v25.05,78.24 25.05,76.8 T502.16
  Bottom 0.254: v25.05,78.24 25.05,78.51 X4.1
SECONDARY_OUT-_N
  Top 0.254: X2.1 25.44,91.94 26.05,91.33 26.05,82.05 X4.3 24.79,80.67 25.85,80.67 27.55,78.97 27.55,76.8 T502.14
SECONDARY_OUT_N
  Top 0.254: R502.1 27.08,62.18 | R502.1 26.57,61.82 26.57,50.83 27.67,49.73 32.85,49.73 34.32,48.26 IC401.10 | T502.3 27.57,62.83 R502.1
SECONDARY_OUT_P
  Top 0.254: T502.1 25.03,62.8 R502.2 25.5,62.48 26.16,61.81 26.16,50.66 27.5,49.33 32.68,49.33 33.46,48.55 33.78,48.22 33.82,48.19 IC401.11
SLOW-PRIMARY
  Top 0.254: R309.2 R310.1 13.92,44.7 14.37,45.16 IC301.13
SLOW-SECONDARY
  Top 0.254: 29.23,44.65 32.16,44.65 32.82,45.32 IC401.13 | 29.23,44.65 R410.1 | 29.23,44.65 29.23,43.43 R409.2

### Text on the board
Top: Fraunhofer IISB / L21586
tNames: PRIMARY | SECONDARY | X3 | X4 | NC | NC | NC | NC | OUT- | OUT+ | OUT- | OUT+ | foxBMS.org | foxBMS BMS-Interface V1.00 | Slow | Slow | Low | Low | High | High | SPI CLK | Enable | SPI CLK | Enable | High | Phase | High | Phase | Low | Pol. | Low | Pol. | LO | HI | LO | HI | PRIMARY | SECONDARY | GND_0 | GND_0 | GND_1 | GND_1 | SCK_0 | CS_0 | SCK_1 | CS_1 | MOSI_0 | MISO_0 | MOSI_1 | MISO_1 | +3.3V | +5.0V | +3.3V | +5.0V
bNames: foxBMS.org | Creative Commons / Attribution 4.0
tStop: Fraunhofer IISB / L21586